# EAGLE design IoTSchem (EAGLE 9.6.2)
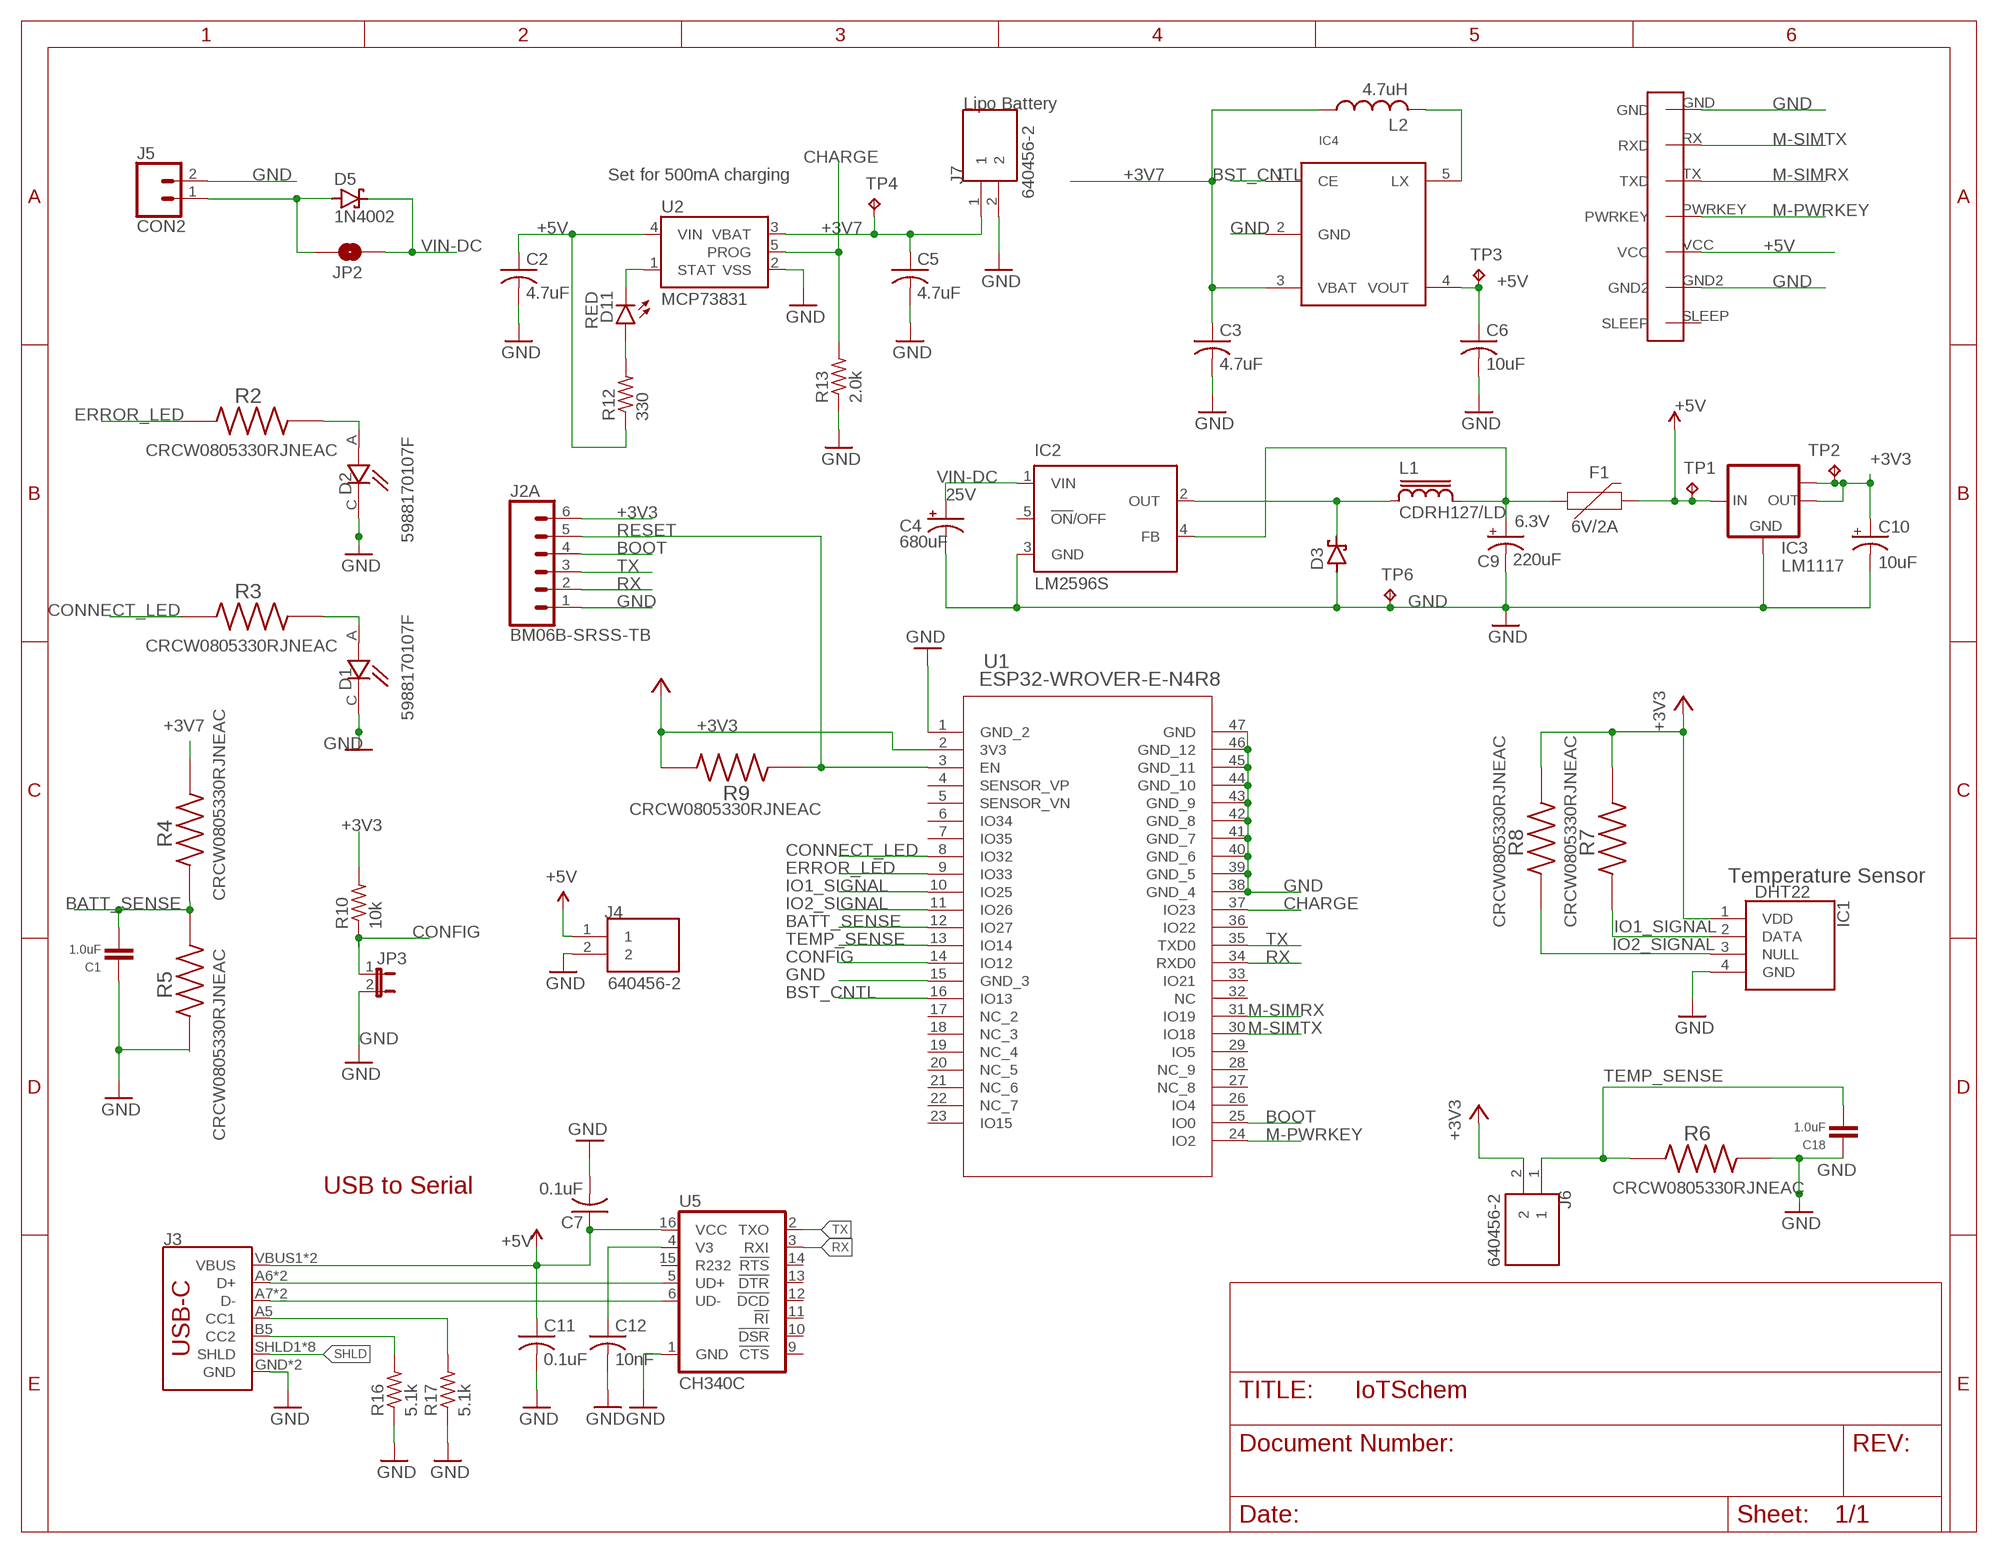
[diagram p0: schematic, sheet 1]

## Parts
C1  1.0uF  1.0UF-0805-25V-(+80/-20%)  [0805]
C2  4.7uF  C-USC0603  [C0603]
C3  4.7uF  C-USC0805  [C0805]
C4  680uF  CPOL-USE5-10.5  [E5-10,5]
C5  4.7uF  C-USC0603  [C0603]
C6  10uF  C-USC0805  [C0805]
C7  0.1uF  C-USC0805  [C0805]
C9  220uF  CPOL-USUD-6,3X5,8  [UD-6,3X5,8_NICHICON]
C10  10uF  10UF-POLAR-EIA3216-16V-10%(TANT)  [EIA3216]
C11  0.1uF  C-USC0805  [C0805]
C12  10nF  C-USC0805  [C0805]
C18  1.0uF  1.0UF-0805-25V-(+80/-20%)  [0805]
D1  5988170107F  [LEDC2012X70N]
D2  5988170107F  [LEDC2012X70N]
D3  SCHOTTKY-DIODESMD  [SMB]
D5  1N4002  SCHOTTKY-DIODESMD  [SMB]
D11  RED  LED-RED0603  [LED-0603@1]
F1  6V/2A  PPTC_6V2A  [1210]
IC1  DHT22  [DHT22]
IC2  LM2596S  [TO263-5]
IC3  LM1117MPX-3.3  [SOT223]
IC4  XC9140  [SOT-25]
J1  SIM7000A  [SIM7000A]
J2  BM06B-SRSS-TB  JST_6_PIN_HORIZONTAL  [JST-6-SMD-HORI-1.0MM]
J3  USB_C16PIN  [USB-C-16P]
J4  640456-2  [TE_640456-2]
J5  CON2  CONN_02  [1X02]
J6  640456-2  [TE_640456-2]
J7  640456-2  [TE_640456-2]
JP2  JUMPER-SMT_2_NO_SILK  [SMT-JUMPER_2_NO_SILK]
JP3  JP1E  [JP1]
L1  CDRH127/LD  [CDRH127/LD]
L2  4.7uH  L-USL2825P  [L2825P]
R2  CRCW0805330RJNEAC  [RESC2012X60N]
R3  CRCW0805330RJNEAC  [RESC2012X60N]
R4  CRCW0805330RJNEAC  [RESC2012X60N]
R5  CRCW0805330RJNEAC  [RESC2012X60N]
R6  CRCW0805330RJNEAC  [RESC2012X60N]
R7  CRCW0805330RJNEAC  [RESC2012X60N]
R8  CRCW0805330RJNEAC  [RESC2012X60N]
R9  CRCW0805330RJNEAC  [RESC2012X60N]
R10  10k  R-US_R0603  [R0603]
R12  330  R-US_R0603  [R0603]
R13  2.0k  R-US_R0603  [R0603]
R16  5.1k  R-US_R0805  [R0805]
R17  5.1k  R-US_R0805  [R0805]
TP1  TPB1,27  [B1,27]
TP2  TPB1,27  [B1,27]
TP3  TPB1,27  [B1,27]
TP4  TPB1,27  [B1,27]
TP6  TPB1,27  [B1,27]
U1  ESP32-WROVER-E-N4R8  [ESP32­WROVER­E/ESP32­WROVER­IE]
U2  MCP73831  [SOT23-5]
U5  CH340C  [SO016]

## Nets
+3V3 [power]: C10.+ IC1.1(VDD) IC3.2(OUT) IC3.TAB(OUT1) J2.6 J6.2 R7.2 R8.2 R9.2 R10.2 TP2.TP U1.2(3V3)
+3V7 [power]: C3.1 C5.1 IC4.3(VBAT) J7.1 L2.1 R4.2 TP4.TP U2.3(VBAT)
+5V [power]: C2.1 C6.1 C7.1 C11.1 F1.2 IC3.3(IN) IC4.4(VOUT) J1.VCC J3.VBUS1(VBUS) J3.VBUS2(VBUS) J4.1 R12.1 TP1.TP TP3.TP U2.4(VIN) U5.16(VCC) ; supply symbol labelled 5V
BATT_SENSE: C1.2 R4.1 R5.2 U1.12(IO27)
BOOT: J2.4 U1.25(IO0)
BST_CNTL: IC4.1(CE) U1.16(IO13)
CC1: J3.A5(CC1) R17.2
CC2: J3.B5(CC2) R16.2
CHARGE: R13.2 U1.37(IO23) U2.5(PROG)
CONFIG: JP3.1 R10.1 U1.14(IO12)
CONNECT_LED: R3.1 U1.8(IO32)
D+: J3.A6(D+) J3.B6(D+) U5.5(UD+)
D-: J3.A7(D-) J3.B7(D-) U5.6(UD-)
ERROR_LED: R2.1 U1.9(IO33)
GND: C1.1 C2.2 C3.2 C4.- C5.2 C6.2 C7.2 C9.- C10.- C11.2 C12.2 C18.1 D1.C D2.C D3.A IC1.4(GND) IC2.3(GND) IC3.1(GND) IC4.2(GND) J1.GND J1.GND2 J2.1 J3.GND J3.GND2(GND) J4.2 J5.2 J7.2 JP3.2 R5.1 R6.2 R13.1 R16.1 R17.1 TP6.TP U1.1(GND_2) U1.15(GND_3) U1.38(GND_4) U1.39(GND_5) U1.40(GND_6) U1.41(GND_7) U1.42(GND_8) U1.43(GND_9) U1.44(GND_10) U1.45(GND_11) U1.46(GND_12) U1.47(GND) U2.2(VSS) U5.1(GND)
IO1_SIGNAL: IC1.2(DATA) R7.1 U1.10(IO25)
IO2_SIGNAL: IC1.3(NULL) R8.1 U1.11(IO26)
M-PWRKEY: J1.PWRKEY U1.24(IO2)
M-SIMRX: J1.TX(TXD) U1.31(IO19)
M-SIMTX: J1.RX(RXD) U1.30(IO18)
N$1: D5.A J5.1 JP2.1
N$2: C12.1 U5.4(V3)
N$3: D11.A R12.2
N$4: IC4.5(LX) L2.2
N$5: D1.A R3.2
N$6: D2.A R2.2
N$9: C9.+ F1.1 IC2.4(FB) L1.2
OUT [ADC]: D3.C IC2.2(OUT) L1.1
RESET: J2.5 R9.1 U1.3(EN)
RX: J2.2 U1.34(RXD0) U5.3(RXI)
SHLD: J3.SHLD1(SHLD) J3.SHLD2(SHLD) J3.SHLD3(SHLD) J3.SHLD4(SHLD) J3.SHLD5(SHLD) J3.SHLD6(SHLD) J3.SHLD7(SHLD) J3.SHLD8(SHLD)
STAT: D11.C U2.1(STAT)
TEMP_SENSE [LOGIC]: C18.2 J6.1 R6.1 U1.13(IO14)
TX: J2.3 U1.35(TXD0) U5.2(TXO)
VIN-DC: C4.+ D5.C IC2.1(VIN) JP2.2
Unconnected: IC2.5(!ON!/OFF) J1.SLEEP J2.M1 J2.M2 U1.4(SENSOR_VP) U1.5(SENSOR_VN) U1.6(IO34) U1.7(IO35) U1.17(NC_2) U1.18(NC_3) U1.19(NC_4) U1.20(NC_5) U1.21(NC_6) U1.22(NC_7) U1.23(IO15) U1.26(IO4) U1.27(NC_8) U1.28(NC_9) U1.29(IO5) U1.32(NC) U1.33(IO21) U1.36(IO22) U5.9(!CTS) U5.10(!DSR) U5.11(!RI) U5.12(!DCD) U5.13(!DTR) U5.14(!RTS) U5.15(R232)

## Notes on the sheet
- Lipo Battery
- Set for 500mA charging
- Temperature Sensor
- USB to Serial

## Library data of the parts
C1 C18 = SparkFun-Capacitors:1.0UF: 1µF ceramic capacitors A capacitor is a passive two-terminal electrical component used to store electrical energy temporarily in an electric field.; PROD_ID: CAP-11625
C2 C3 C5-C7 C11 C12 = rcl:C-US: CAPACITOR, American symbol; SPICEPREFIX: C
C4 = rcl:CPOL-US: POLARIZED CAPACITOR, American symbol; VOLTAGE: 25V
C9 = rcl:CPOL-US: POLARIZED CAPACITOR, American symbol; VOLTAGE: 6.3V
C10 = SparkFun-Capacitors:10UF-POLAR: 10.0µF polarized capacitors A capacitor is a passive two-terminal electrical component used to store electrical energy temporarily in an electric field.; PROD_ID: CAP-00811
D1 D2 = 5988170107F:5988170107F: Standard LEDs - SMD Green Water Clr 40mcd 570nm; DESCRIPTION: Green 566nm LED Indication - Discrete 2V 0805 (2012 Metric); DIGI-KEY_PART_NUMBER: 350-2044-1-ND; MF: Dialight; MP: 5988170107F; PACKAGE: 0805 Dialight; PURCHASE-URL: https://pricing.snapeda.com/search/part/5988170107F/?ref=eda
D3 D5 = diode:SCHOTTKY-DIODE: Schottky Diode
D11 = SparkFun-LED:LED-RED: Red SMD LED Used in manufacturing of most products at SparkFun Packages: 0603 - SMD 0603 package [Product Link] <http://docs.avagotech.com/docs/AV02-0551EN> 0603 SMART - SMD 0603 SMART package ( more efficient and expensive)[Product Link] <http://www.osram-os.com/Graphics/XPic2/00077099_0.pdf> 1206 - SMD1206 package [Product Link] <https://www.sparkfun.com/datasheets/DevTools/LilyPad/Q150OVS4.pdff> SparkFun Products: Pro Mini 328 -5V <https://www.sparkfun.com/products/821> RedBoard <https://www.sparkfun.com/products/12757> IOIO-OTG <https://www.sparkfun.com/products/13613>; PROD_ID: DIO-00819
F1 = SparkFun-Fuses:PPTC: Resettable Fuse PPTC Resettable Fuse. Really a sort of resistor with a polymeric positive temperature coefficient whose resistance increases dramatically with an increase in temperature. When heated by the power passing through the resistance rises causing the current to be limited, protecting the circuit. This is achieved by the transition of the polymer from a crystalline to an amorphous state where the conductive carbon separates breaking the conductive pathways found in the cool crystalline structure. When a PPTC cools back down it resumes conducting letting the circuit turn back on. SparkFun Products: SparkFun RedBoard - Programmed with Arduino <https://www.sparkfun.com/products/12757> Pro Micro - 5V/16MHz <https://www.sparkfun.com/products/12640> Arduino Pro 328 - 5V/16MHz <https://www.sparkfun.com/products/10915> MP3 Trigger <https://www.sparkfun.com/products/13720>; PROD_ID: RES-14313
IC1 = DHT22:DHT22: Digital-output relative humidity & temperature sensor/module DHT22 Source: Datasheet <https://datasheet4u.com/datasheet-parts/DHT22-datasheet.php?id=792211>; DESCRIPTION: Digital-output relative humidity & temperature sensor/module DHT22; HEIGHT: 25.1mm; MANUFACTURER_NAME: Aosong Electronics; MANUFACTURER_PART_NUMBER: DHT22
IC2 = national-semiconductor:LM2596: SIMPLE SWITCHER® Power Converter 150 kHz 3A Step-Down Voltage Regulator Source: http://www.national.com/ds/LM/LM2596.pdf; MF: NATIONAL SEMICONDUCTOR; MPN: LM2596S-ADJ/NOPB; OC_FARNELL: 9494367; OC_NEWARK: 41K3842
IC3 = lm1117:LM1117MPX-*
IC4 = MyLIb:XC9140
J1 = SoftwareLogisticsParts:SIM7000A
J2 = SparkFun-Connectors:JST_6_PIN_HORIZONTAL: JST 6 pin horizontal connector JST-SH type. Here is the connector we sell at SparkFun: name <link> (XXX-00000) Datasheet <http://www.sparkfun.com/datasheets/GPS/EM406-SMDConnector-eSH.pdf> It was used on these SparkFun products: name <link> (XXX-00000) name <link> (XXX-00000); PROD_ID: XXX-00000
J3 = SparkFun-Connectors:USB_C: USB Type C 16Pin Connector Super Speed pins not available on the 16-pin purely SMD connector so this part is best for USB 2.0 implementations. D1 and D2 are tied together enabling D+/- no matter which way the cable is plugged into the connector. The two channel configuration pins (CC1/2) are exposed. These are normally connected to ground via 5.1k resistors but can be reconfigured for high current/high power applications.; PROD_ID: CONN-14122
J4 J6 J7 = 640456-2:640456-2: 220P MTA100 HDR ASSY SQ SPCL; COMMENT: 640456-2; DESCRIPTION: Connector Header Through Hole 2 position 0.100 (2.54mm); DIGI-KEY_PART_NUMBER: A1921-ND; EU_ROHS_COMPLIANCE: Compliant; MF: TE Connectivity; MP: 640456-2; PACKAGE: None; PURCHASE-URL: https://pricing.snapeda.com/search/part/640456-2/?ref=eda
J5 = SparkFun-Connectors:CONN_02: Multi connection point. Often used as Generic Header-pin footprint for 0.1 inch spaced/style header connections On any of the 0.1 inch spaced packages, you can populate with these: Break Away Headers - Straight <https://www.sparkfun.com/products/116> (PRT-00116) Break Away Male Headers - Right Angle <https://www.sparkfun.com/products/553> (PRT-00553) Female Headers <https://www.sparkfun.com/products/115> (PRT-00115) Break Away Headers - Machine Pin <https://www.sparkfun.com/products/117> (PRT-00117) Break Away Female Headers - Swiss Machine Pin <https://www.sparkfun.com/products/743> (PRT-00743) For SCREWTERMINALS and SPRING TERMINALS visit here: Screw Terimnals on SparkFun.com <https://www.sparkfun.com/search/results?term=Screw+Terminals> (5mm/3.5mm/2.54mm spacing) This device is also useful as a general connection point to wire up your design to another part of your project. Our various solder wires solder well into these plated through hole pads. Hook-Up Wire - Assortment (Stranded, 22 AWG) <https://www.sparkfun.com/products/11375> (PRT-11375) Hook-Up Wire - Assortment (Solid Core, 22 AWG) <https://www.sparkfun.com/products/11367> (PRT-11367) View the entire wire category on our website here <https://www.sparkfun.com/categories/141> Special notes: Molex polarized connector foot print use with: PRT-08233 with associated crimp pins and housings. 2.54_SCREWTERM for use with PRT-10571. 3.5mm Screw Terminal footprints for PRT-08084 5mm Screw Terminal footprints for use with PRT-08432
JP2 = SparkFun-Jumpers:JUMPER-SMT_2_NO: Normally open jumper This jumper has two pads in close proximity to each other. Apply solder to close the connection. Round pads are easier to solder for beginners, but are a lot larger. SparkFun Product that uses the round pads: SparkFun EL Sequencer <https://www.sparkfun.com/products/12781>
JP3 = jumper:JP1E: JUMPER
L1 = inductor-sumida:CDRH127/LD: Power Inductor
L2 = rcl:L-US: INDUCTOR, American symbol; SPICEPREFIX: L
R2-R9 = CRCW0805330RJNEAC:CRCW0805330RJNEAC; DESCRIPTION: 330 Ohms ±5% 0.125W, 1/8W Chip Resistor 0805 (2012 Metric) - Thick Film; DIGI-KEY_PART_NUMBER: 541-4168-1-ND; MF: Vishay; MP: CRCW0805330RJNEAC; PACKAGE: 2012 Vishay; PURCHASE-URL: https://pricing.snapeda.com/search/part/CRCW0805330RJNEAC/?ref=eda
R10 R12 R13 R16 R17 = rcl:R-US_: RESISTOR, American symbol; SPICEPREFIX: R
TP1-TP4 TP6 = testpad:TP: Test pad
U1 = ESP32WROVER:ESP32-WROVER-E-N4R8; COPYRIGHT: Copyright (C) 2022 Ultra Librarian. All rights reserved.; DIGI-KEY_PART_NUMBER_1: 1965-ESP32-WROVER-E-N4R8TR-ND; DIGI-KEY_PART_NUMBER_2: 1965-ESP32-WROVER-E-N4R8CT-ND; DIGI-KEY_PART_NUMBER_3: 1965-ESP32-WROVER-E-N4R8DKR-ND; MANUFACTURER_PART_NUMBER: ESP32-WROVER-E-N4R8; MFR_NAME: Espressif Systems
U2 = SparkFun-PowerIC:MCP73831: Miniature single cell, fully integrated Li-Ion, Li-polymer charge management controller http://ww1.microchip.com/downloads/en/DeviceDoc/21984a.pdf IC-09995; PROD_ID: IC-09995
U5 = SparkFun-IC-Comms:CH340C; PROD_ID: IC-14038

## Net classes
0 default: width 0.305 mm, drill 0.508 mm, clearance 0.305 mm
1 power: width 0.305 mm, drill 0.508 mm, clearance 0.305 mm
3 LOGIC: width 0.305 mm, drill 0.508 mm, clearance 0.305 mm
4 ADC: width 0.305 mm, drill 0.508 mm, clearance 0.305 mm

## Board
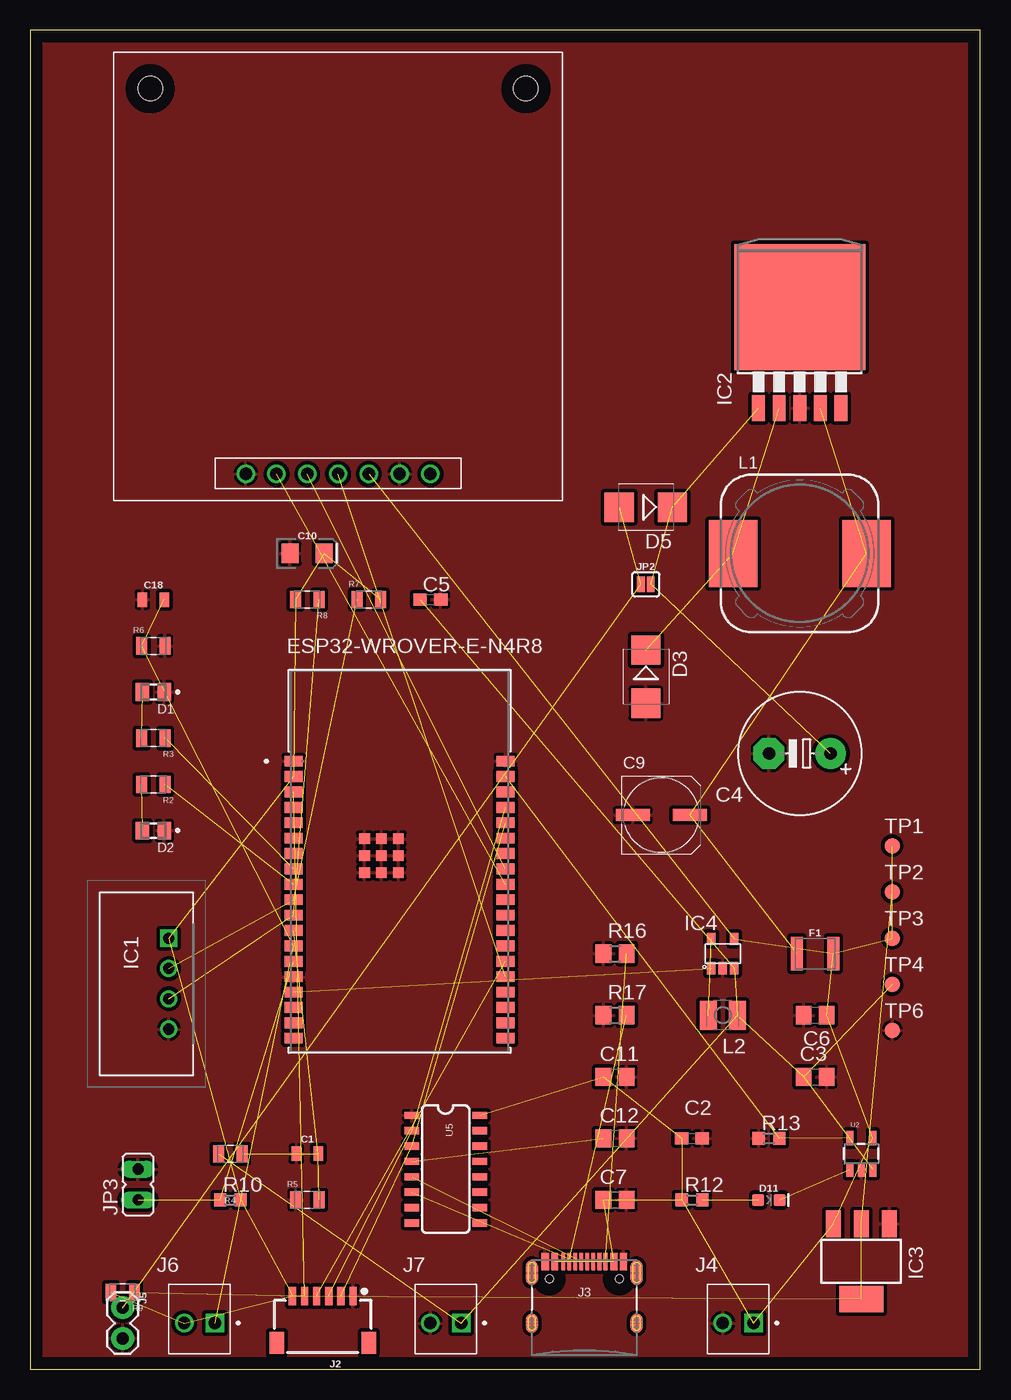
[diagram p1: board, top side]
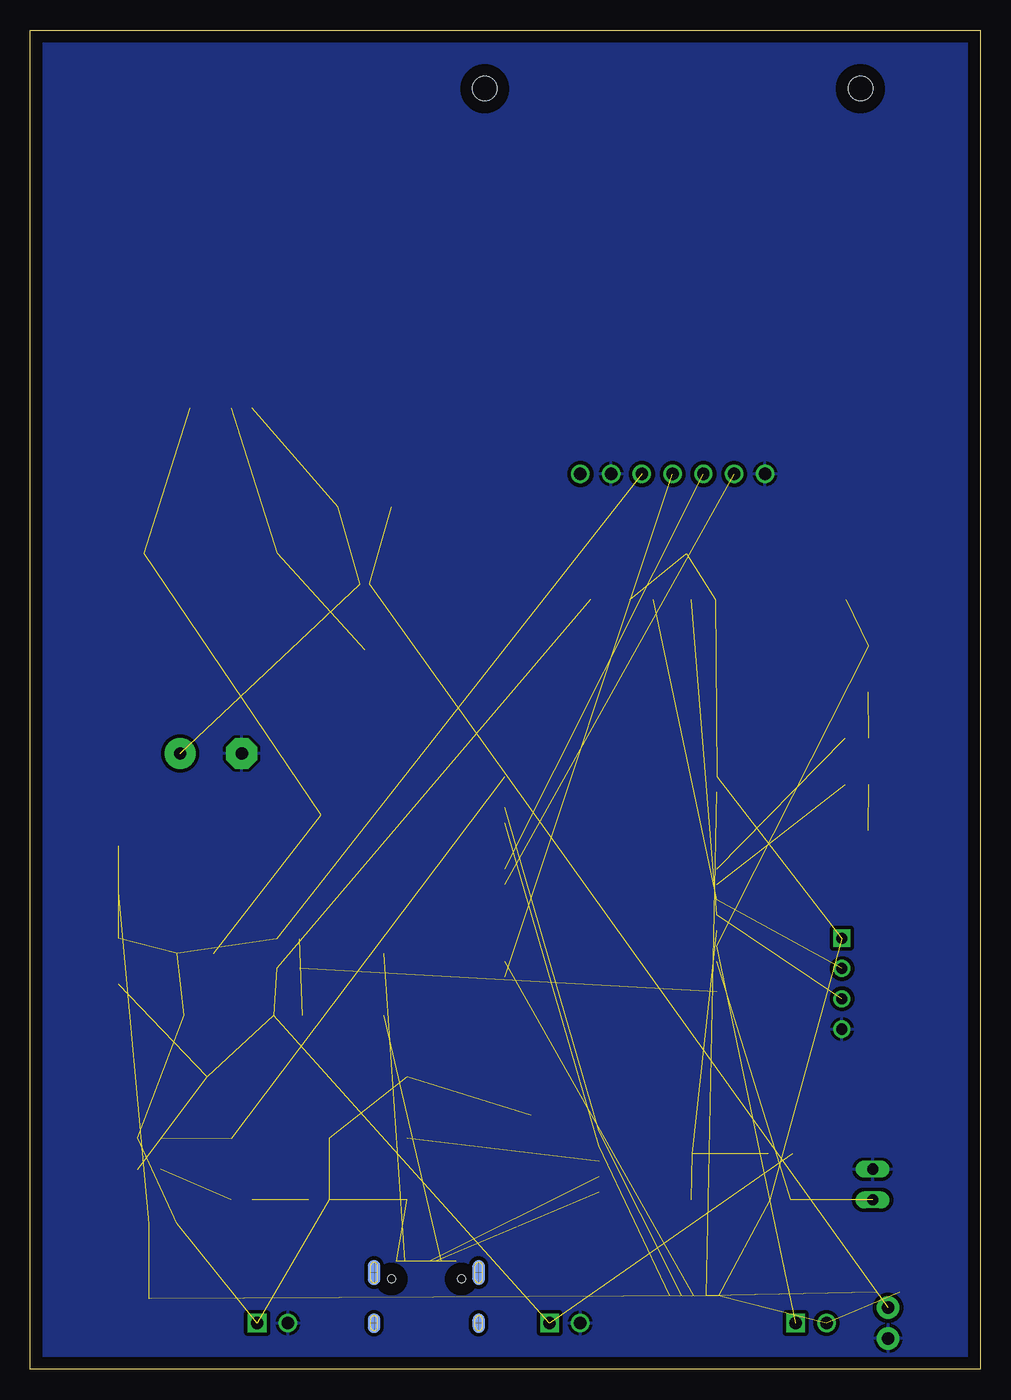
[diagram p2: board, bottom side, seen from below]

Size 78.41 x 110.48 mm. Coordinates in mm from the lower left corner, seen from the top.
Outline: 0,0 78.41,0 78.41,110.48 0,110.48 0,0
Copper layers (1*16): Top 0.035mm / dielectric 1.5mm / Bottom 0.035mm
Design rules "default": minimum track width 6mil, minimum drill 0.35mm, track to track 6mil, track to pad 6mil, pad to pad 6mil, via to via 6mil, smd to smd 6mil, copper to edge 40mil, drill to drill 6mil, minimum pad ring 10mil, minimum via ring 8mil, stop-mask expansion 4mil, vias tented up to drill 0mil, thermal gap 10mil

### Footprints (pad centres in the part's own frame; a part is rotated, then mirrored left to right if it is on the bottom)
0805 = smd 0.8 x 1.2: 1 -0.9,0; 2 0.9,0
C0603 = smd 1.1 x 1: 1 -0.85,0; 2 0.85,0
C0805 = smd 1.3 x 1.5: 1 -0.95,0; 2 0.95,0
E5-10,5 = drill 1.016 pad 2.54: + -2.54,0 | drill 1.016 pad 2.54 octagon: - 2.54,0
UD-6,3X5,8_NICHICON = smd 2.8 x 1: + 2.35,0; - -2.35,0
EIA3216 = smd 1.4 x 1.6: + 1.4,0; - -1.4,0
LEDC2012X70N = smd 1.1 x 1.45: A 0.9,0; C -0.9,0
SMB = smd 2.4 x 2.4: A 2.2,0; C -2.2,0
LED-0603@1 = smd 1 x 1: A -0.877,0; C 0.877,0
1210 = smd 1 x 2.8: 1 -1.5,0; 2 1.5,0
DHT22 = drill 0.91 pad 1.416 square: 1 0,0 | drill 0.91 pad 1.416: 2 2.5,0; 3 5,0; 4 7.5,0
TO263-5 = smd 1.067 x 2.159: 1 -3.404,-5.791; 2 -1.702,-5.791; 3 0,-5.791; 4 1.702,-5.791; 5 3.404,-5.791 | smd 10.8 x 10.41: 6 0,2.54
SOT223 = smd 1.219 x 2.235: 1 -2.311,-3.099; 2 0,-3.099; 3 2.311,-3.099 | smd 3.6 x 2.2: TAB 0,3.099
SOT-25 = smd 0.7 x 1: 1 -0.95,-1.2; 2 0,-1.2; 3 0.95,-1.2; 4 0.95,1.2; 5 -0.95,1.2
SIM7000A = drill 1.016: GND -16.3,7.62; GND2 -16.3,-5.08; PWRKEY -16.3,0; RX -16.3,5.08; SLEEP -16.3,-7.62; TX -16.3,2.54; VCC -16.3,-2.54 | hole 2: 15.5,-15.5; 15.5,15.5
JST-6-SMD-HORI-1.0MM = smd 0.6 x 1.55: 1 -2.5,-4.775; 2 -1.5,-4.775; 3 -0.5,-4.775; 4 0.5,-4.775; 5 1.5,-4.775; 6 2.5,-4.775 | smd 1.2 x 1.8: M1 -3.8,-0.9; M2 3.8,-0.9
USB-C-16P = smd 0.3 x 1.45: A5 -1.25,0; A6 -0.25,0; A7 0.25,0; A8 1.25,0; B5 1.75,0; B6 0.75,0; B7 -0.75,0; B8 -1.75,0 | smd 0.6 x 1.45: GND -3.225,0; GND2 3.225,0 | smd 1 x 2.1: SHLD1 -4.32,-0.915; SHLD2 4.32,-0.915 | smd 1 x 2.1 bottom: SHLD3 -4.32,-0.915; SHLD4 4.32,-0.915 | smd 1 x 1.6: SHLD5 -4.32,-5.095; SHLD8 4.32,-5.095 | smd 1 x 1.6 bottom: SHLD6 -4.32,-5.095; SHLD7 4.32,-5.095 | smd 0.55 x 1.45: VBUS1 -2.45,0; VBUS2 2.45,0 | hole 0.65: -2.89,-1.445; 2.89,-1.445
TE_640456-2 = drill 1.02 pad 1.37 square: 1 0,0 | drill 1.02 pad 1.37: 2 -2.54,0
1X02 = drill 1.016 pad 1.88: 1 0,0; 2 2.54,0
SMT-JUMPER_2_NO_SILK = smd 0.635 x 1.27: 1 -0.406,0; 2 0.406,0
JP1 = drill 0.914 long: 1 0,-1.27; 2 0,1.27
CDRH127/LD = smd 4 x 5.5: 1 -5.5,0; 2 5.5,0
L2825P = smd 1.4 x 2.4: 1 -1.2,0; 2 1.2,0
RESC2012X60N = smd 0.89 x 1.42: 1 -0.97,0; 2 0.97,0
R0603 = smd 1 x 1.1: 1 -0.85,0; 2 0.85,0
R0805 = smd 1.3 x 1.5: 1 -0.95,0; 2 0.95,0
B1,27 = smd 1.27 x 1.27: TP 0,0
ESP32­WROVER­E/ESP32­WROVER­IE = smd 1.499 x 0.889: 1 -8.75,8.26; 2 -8.75,6.99; 3 -8.75,5.72; 4 -8.75,4.45; 5 -8.75,3.18; 6 -8.75,1.91; 7 -8.75,0.64; 8 -8.75,-0.63; 9 -8.75,-1.9; 10 -8.75,-3.17; 11 -8.75,-4.44; 12 -8.75,-5.71; 13 -8.75,-6.98; 14 -8.75,-8.25; 15 -8.75,-9.52; 16 -8.75,-10.79; 17 -8.75,-12.06; 18 -8.75,-13.33; 19 -8.75,-14.6; 20 8.75,-14.6; 21 8.75,-13.33; 22 8.75,-12.06; 23 8.75,-10.79; 24 8.75,-9.52; 25 8.75,-8.25; 26 8.75,-6.98; 27 8.75,-5.71; 28 8.75,-4.44; 29 8.75,-3.17; 30 8.75,-1.9; 31 8.75,-0.63; 32 8.75,0.64; 33 8.75,1.91; 34 8.75,3.18; 35 8.75,4.45; 36 8.75,5.72; 37 8.75,6.99; 38 8.75,8.26 | smd 0.889 x 0.889: 39 -2.903,1.862; 40 -1.504,1.862; 41 -0.104,1.862; 42 -2.903,0.462; 43 -1.504,0.462; 44 -0.104,0.462; 45 -2.903,-0.937; 46 -1.504,-0.937; 47 -0.104,-0.937
SOT23-5 = smd 0.55 x 1.2: 1 -0.95,-1.3; 2 0,-1.3; 3 0.95,-1.3; 4 0.95,1.3; 5 -0.95,1.3
SO016 = smd 0.6 x 1.2: 1 -4.445,-2.8; 2 -3.175,-2.8; 3 -1.905,-2.8; 4 -0.635,-2.8; 5 0.635,-2.8; 6 1.905,-2.8; 7 3.175,-2.8; 8 4.445,-2.8; 9 4.445,2.8; 10 3.175,2.8; 11 1.905,2.8; 12 0.635,2.8; 13 -0.635,2.8; 14 -1.905,2.8; 15 -3.175,2.8; 16 -4.445,2.8

### Placement (x,y rotation side)
C1  22.86,17.78 0 top
C2  54.61,19.05 0 top
C3  64.77,24.13 0 top
C4  63.5,50.8 180 top
C5  33.02,63.5 0 top
C6  64.77,29.21 180 top
C7  48.26,13.97 0 top
C9  52.07,45.72 0 top
C10  22.86,67.31 0 top
C11  48.26,24.13 0 top
C12  48.26,19.05 0 top
C18  10.16,63.5 0 top
D1  10.16,55.88 180 top
D2  10.16,44.45 180 top
D3  50.8,57.15 270 top
D5  50.8,71.12 180 top
D11  60.96,13.97 0 top
F1  64.77,34.29 0 top
IC1  11.43,35.56 270 top
IC2  63.5,85.09 0 top
IC3  68.58,8.89 180 top
IC4  57.15,34.29 0 top
J1  25.4,90.17 90 top
J2  24.13,1.27 180 top
J3  45.72,8.89 0 top
J4  59.69,3.81 0 top
J5  7.62,5.08 270 top
J6  15.24,3.81 0 top
J7  35.56,3.81 0 top
JP2  50.8,64.77 0 top
JP3  8.89,15.24 0 top
L1  63.5,67.31 0 top
L2  57.15,29.21 180 top
R2  10.16,48.26 180 top
R3  10.16,52.07 180 top
R4  16.51,17.78 180 top
R5  22.86,13.97 0 top
R6  10.16,59.69 0 top
R7  27.94,63.5 0 top
R8  22.86,63.5 180 top
R9  7.62,6.35 180 top
R10  16.51,13.97 0 top
R12  54.61,13.97 0 top
R13  60.96,19.05 0 top
R16  48.26,34.29 0 top
R17  48.26,29.21 0 top
TP1  71.12,43.18 0 top
TP2  71.12,39.37 0 top
TP3  71.12,35.56 0 top
TP4  71.12,31.75 0 top
TP6  71.12,27.94 0 top
U1  30.48,41.91 0 top
U2  68.58,17.78 0 top
U5  34.29,16.51 270 top

### Tracks (layer width: path | path; a pad name or v marks a point on that pad's centre or on a via)
+3V3  (11 unrouted)
+3V7  (7 unrouted)
+5V  (15 unrouted)
BATT_SENSE  (3 unrouted)
BOOT  (1 unrouted)
BST_CNTL  (1 unrouted)
CC1  (1 unrouted)
CC2  (1 unrouted)
CHARGE  (2 unrouted)
CONFIG  (2 unrouted)
CONNECT_LED  (1 unrouted)
D+  (1 unrouted)
D-  (2 unrouted)
ERROR_LED  (1 unrouted)
GND
  pour Top: 82.55,116.84
  pour Top: -1.27,-1.27 80.01,-1.27 80.01,111.76 -1.27,111.76
  pour Bottom: -2.54,-2.54 81.28,-2.54 81.28,113.03 -2.54,113.03
IO1_SIGNAL  (2 unrouted)
IO2_SIGNAL  (2 unrouted)
M-PWRKEY  (1 unrouted)
M-SIMRX  (1 unrouted)
M-SIMTX  (1 unrouted)
N$1  (2 unrouted)
N$2  (1 unrouted)
N$3  (1 unrouted)
N$4  (1 unrouted)
N$5  (1 unrouted)
N$6  (1 unrouted)
N$9  (3 unrouted)
OUT  (2 unrouted)
RESET  (2 unrouted)
RX  (2 unrouted)
STAT  (1 unrouted)
TEMP_SENSE  (3 unrouted)
TX  (2 unrouted)
VIN-DC  (3 unrouted)